# EAGLE board BITalino_V3 (EAGLE 6.3)
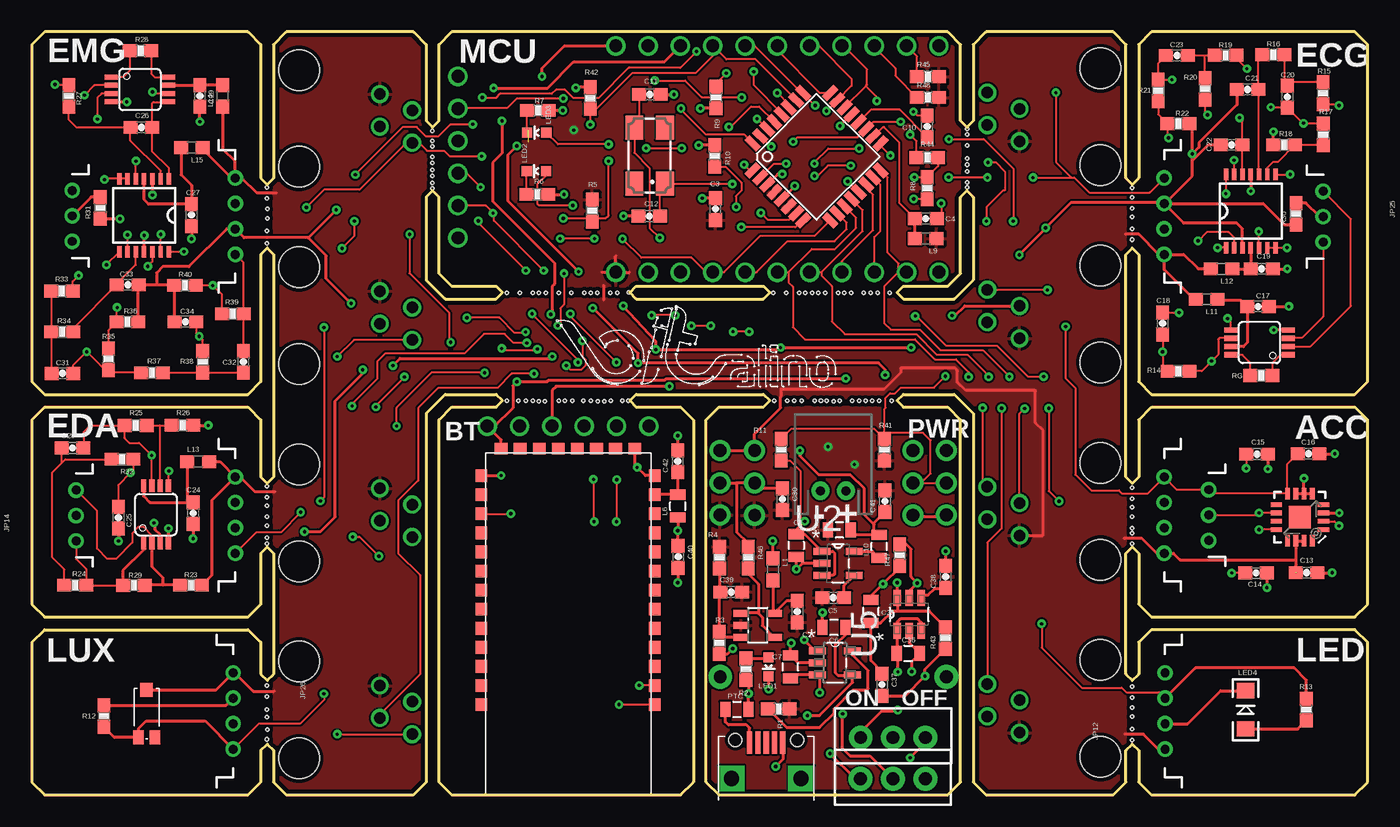
[diagram p3: board, top side]
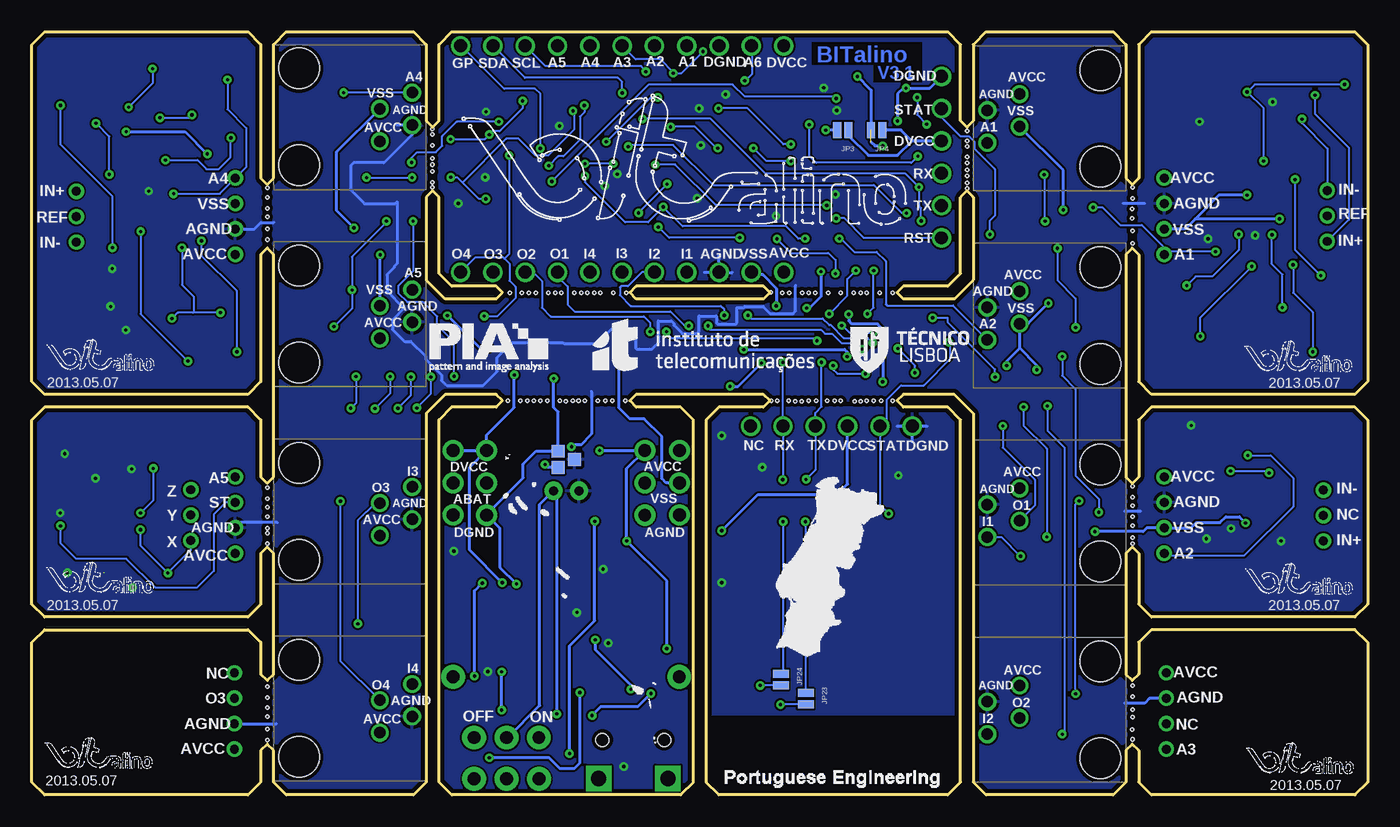
[diagram p4: board, bottom side, seen from below]

Size 105 x 60 mm. Coordinates in mm from the lower left corner, seen from the top.
Outline: 105,1 105,12 104,13 88,13 87,12 87,9.5 86.5,9 86,9.5 86,19 86.5,19.5 87,19 87,15 88,14 104,14 105,15 105,29.5 104,30.5 88,30.5 87,29.5 87,25 86.5,24.5 86,25 86,42.5 86.5,43 87,42.5 87,32.5 88,31.5 104,31.5 105,32.5 105,59 104,60 88,60 87,59 87,48.5 86.5,48 86,48.5 86,59 85,60 75,60 74,59 74,53 73.5,52.5 73,53 73,59 72,60 33,60 32,59 32,53 31.5,52.5 31,53 31,59 30,60 20,60 19,59 19,48.5 18.5,48 18,48.5 18,59 17,60 1,60 0,59 0,32.5 1,31.5 17,31.5 18,32.5 18,42.5 18.5,43 19,42.5 19,25 18.5,24.5 18,25 18,29.5 17,30.5 1,30.5 0,29.5 0,15 1,14 17,14 18,15 18,19 18.5,19.5 19,19 19,9.5 18.5,9 18,9.5 18,12 17,13 1,13 0,12 0,1 1,0 17,0 18,1 18,3.5 18.5,4 19,3.5 19,1 20,0 30,0 31,1 31,30 32.5,31.5 36.5,31.5 37,31 36.5,30.5 33,30.5 32,29.5 32,1 33,0 51,0 52,1 52,29.5 51,30.5 47.5,30.5 47,31 47.5,31.5 57.5,31.5 58,31 57.5,30.5 54,30.5 53,29.5 53,1 54,0 72,0 73,1 73,29.5 72,30.5 68.5,30.5 68,31 68.5,31.5 72.5,31.5 74,30 74,1 75,0 85,0 86,1 86,3.5 86.5,4 87,3.5 87,1 88,0 104,0 105,1
Outline: 74,47 74,40.5 72.5,39 68.5,39 68,39.5 68.5,40 72,40 73,41 73,47 73.5,47.5 74,47
Outline: 32,41 32,47 31.5,47.5 31,47 31,40.5 32.5,39 36.5,39 37,39.5 36.5,40 33,40 32,41
Outline: 47.5,40 57.5,40 58,39.5 57.5,39 47.5,39 47,39.5 47.5,40
Copper layers (1*16): Top 0.035mm / dielectric 1.5mm / Bottom 0.035mm
Design rules "default *": minimum track width 6mil, minimum drill 10mil, track to track 6mil, track to pad 6mil, pad to pad 8mil, via to via 8mil, smd to smd 8mil, copper to edge 12mil, drill to drill 8mil, minimum pad ring 10mil, minimum via ring 8mil, stop-mask expansion 4mil, vias tented up to drill 0mil, thermal gap 10mil
Holes 0.25 mm at 18.49,46.91 18.52,46.08 18.52,45.34 18.49,44.35 18.49,43.36 37.34,30.99 18.49,23.42 18.49,22.76 18.49,21.87 18.49,21.18 18.49,20.24 18.49,19.76 18.49,6.73 18.49,6.12 18.52,5.14 18.49,4.38 37.34,39.5 38.35,39.5 39.37,39.5 40.39,39.5 41.4,39.5 42.42,39.5 43.43,39.5 44.45,39.5 45.47,39.5 38.25,30.99 39.37,30.99 40.31,30.96 41.4,30.99 42.49,30.99 43.36,30.99 44.48,30.96 45.49,30.99 46.41,30.99 58.37,30.99 59.36,30.99 60.5,30.99 61.52,30.99 62.48,30.99 63.5,30.99 64.49,30.99 65.53,30.99 66.6,30.99 67.59,30.99 58.29,39.5 59.31,39.5 60.33,39.5 61.34,39.5 62.36,39.5 63.37,39.5 64.39,39.5 65.41,39.5 66.47,39.5 67.44,39.5 31.5,52.2 31.5,51 31.5,50.16 31.5,49.15 31.5,48.13 73.51,51.94 73.51,51.05 73.51,50.04 73.51,49.02 73.51,48.16 86.49,47.73 86.49,46.99 86.49,46.13 86.49,45.44 86.49,44.5 86.49,43.66 86.49,24.16 86.49,23.29 86.49,22.61 86.49,21.89 86.49,20.98 86.49,20.6 86.49,8.53 86.49,7.67 86.49,6.86 86.49,6.15 86.49,5.18 18.49,47.77 18.49,24.27 18.49,7.73 86.49,19.74 46.92,39.52 18.49,8.59 86.49,4.32 46,39.5 43.92,39.5 39.85,39.5 61.82,39.47 60.81,39.5 63.86,39.5 65.94,39.5 38.81,30.99 41.91,30.99 43.94,30.99 45.01,30.96 39.85,30.96 59.92,30.99 62.03,30.99 63.02,30.96 65.05,30.99 66.07,30.99 31.5,47.7 31.5,48.67 31.5,49.68 73.51,49.56 46.86,30.99 31.5,51.41 73.51,47.75 73.51,52.35

## Footprints (pad centres in the part's own frame; a part is rotated, then mirrored left to right if it is on the bottom)
SMD = drill 0.9: 1 -6.36,-1.9; 2 -8.9,-3.17; 3 -8.9,-5.72; 4 -6.36,-4.45 | hole 3.2: 0,-7.62; 0,0
0805 = smd 0.8 x 1.2: 1 -0.9,0; 2 0.9,0
0603-CAP = smd 1.1 x 1: 1 -0.85,0; 2 0.85,0
SOT23-5 = smd 0.55 x 1.2: 1 -0.95,-1.3; 2 0,-1.3; 3 0.95,-1.3; 4 0.95,1.3; 5 -0.95,1.3
MSOP08 = smd 0.4 x 1: 1 -0.976,-2.263; 2 -0.326,-2.263; 3 0.324,-2.263; 4 0.974,-2.263; 5 0.974,2.262; 6 0.324,2.262; 7 -0.326,2.262; 8 -0.976,2.262
TSSOP14 = smd 0.9 x 0.35: 1 -2.875,1.95; 2 -2.875,1.3; 3 -2.875,0.65; 4 -2.875,0; 5 -2.875,-0.65; 6 -2.875,-1.3; 7 -2.875,-1.95; 8 2.875,-1.95; 9 2.875,-1.3; 10 2.875,-0.65; 11 2.875,0; 12 2.875,0.65; 13 2.875,1.3; 14 2.875,1.95
JST-2-PTH-NS = drill 0.7 pad 1.448: 1 -1,0; 2 1,0
FCI-10103594-0001LF = smd 0.4 x 1.75: 1 -1.3,4.525; 2 -0.65,4.525; 3 0,4.525; 4 0.65,4.525; 5 1.3,4.525 | drill 1.2 pad 2 square: P$3 -2.725,1.7; P$4 2.725,1.7 | hole 1.05: -2.425,4.73; 2.425,4.73
SJ_2S-NO-NS = smd 0.635 x 1.27: 1 -0.45,0; 2 0.45,0
JST-3-PTH = drill 0.7: 1 -2,-5; 2 0,-5; 3 2,-5
JST-4-PTH = drill 0.7: 1 -3,-5; 2 -1,-5; 3 1,-5; 4 3,-5
1X03_NO_SILK = drill 1.016 pad 1.651: 1 0,0; 2 2.54,0; 3 5.08,0
1X06_HOLES_ONLY = drill 1.016 pad 1.27: 1 0,0; 7 2.54,0; 8 5.08,0; 9 7.62,0; 10 10.16,0; 11 12.7,0 | drill 0.889 pad 0.813: 2 2.54,0; 3 5.08,0; 4 7.62,0; 5 10.16,0; 6 12.7,0
1X11_HOLES_ONLY = drill 1.016 pad 1.27: 1 0,0; 12 5.08,0; 13 7.62,0; P$1 2.54,0; P$2 10.16,0; P$3 12.7,0; P$4 15.24,0; P$5 17.78,0; P$6 20.32,0; P$7 22.86,0; P$8 25.4,0 | drill 0.889 pad 0.813: 2 2.54,0; 3 5.08,0; 4 7.62,0; 5 10.16,0; 6 12.7,0; 7 15.24,0; 8 17.78,0; 9 20.32,0; 10 22.86,0; 11 25.4,0
1X01NS = drill 1.016 pad 1.88: 1 0,0
0603 = smd 1.1 x 1: 1 -0.85,0; 2 0.85,0
LED-0603 = smd 0.8 x 0.8: A 0,-0.75; C 0,0.75
LED-1206 = smd 1.2 x 1.4: A -1.5,0; C 1.5,0
CTS406 = smd 1.9 x 1.4: 1 -2.2,-1.2; 2 2.2,-1.2; 3 2.2,1.2; 4 -2.2,1.2
0603-RES = smd 1.1 x 1: 1 -0.85,0; 2 0.85,0
SWITCH-SPDT = drill 1.016 pad 1.88: 1 0,2.54; 2 0,0; 3 0,-2.54
SOT95P300X145-5N = smd 1.321 x 0.559: 1 -1.372,0.94; 2 -1.372,0; 3 -1.372,-0.94; 4 1.372,-0.94; 5 1.372,0.94
SOT95P280X130-5N = smd 1.321 x 0.559: 1 -1.27,0.94; 2 -1.27,0; 3 -1.27,-0.94; 4 1.27,-0.94; 5 1.27,0.94
TQFP32-08 = smd 1.27 x 0.559: 1 -4.293,2.8; 2 -4.293,2; 3 -4.293,1.2; 4 -4.293,0.4; 5 -4.293,-0.4; 6 -4.293,-1.2; 7 -4.293,-2; 8 -4.293,-2.8; 17 4.293,-2.8; 18 4.293,-2; 19 4.293,-1.2; 20 4.293,-0.4; 21 4.293,0.4; 22 4.293,1.2; 23 4.293,2; 24 4.293,2.8 | smd 0.559 x 1.27: 9 -2.8,-4.293; 10 -2,-4.293; 11 -1.2,-4.293; 12 -0.4,-4.293; 13 0.4,-4.293; 14 1.2,-4.293; 15 2,-4.293; 16 2.8,-4.293; 25 2.8,4.293; 26 2,4.293; 27 1.2,4.293; 28 0.4,4.293; 29 -0.4,4.293; 30 -1.2,4.293; 31 -2,4.293; 32 -2.8,4.293
LFCSP-16 = smd 1.75 x 1.75: 0 0,0 | smd 0.889 x 0.37: 1 -1.852,0.975; 2 -1.852,0.325; 3 -1.852,-0.325; 4 -1.852,-0.975; 9 1.852,-0.975; 10 1.852,-0.325; 11 1.852,0.325; 12 1.852,0.975 | smd 0.37 x 0.889: 5 -0.975,-1.852; 6 -0.325,-1.852; 7 0.325,-1.852; 8 0.975,-1.852; 13 0.975,1.852; 14 0.325,1.852; 15 -0.325,1.852; 16 -0.975,1.852
SOT95P280X145-6N = smd 1.27 x 0.559: 1 -1.295,0.94; 2 -1.295,0; 3 -1.295,-0.94; 4 1.295,-0.94; 5 1.295,0; 6 1.295,0.94
BLUETOOTH = smd 0.9 x 1: P$1 -0.312,19.79; P$2 -0.312,18.29; P$3 -0.312,16.79; P$4 -0.312,15.29; P$5 -0.312,13.79; P$6 -0.312,12.29; P$7 -0.312,10.79; P$8 -0.312,9.29; P$9 -0.312,7.79; P$10 -0.312,6.29; P$11 -0.312,4.79; P$12 -0.312,3.29; P$13 -0.312,1.79; P$22 13.312,1.79; P$23 13.312,3.29; P$24 13.312,4.79; P$25 13.312,6.29; P$26 13.312,7.79; P$27 13.312,9.29; P$28 13.312,10.79; P$29 13.312,12.29; P$30 13.312,13.79; P$31 13.312,15.29; P$32 13.312,16.79; P$33 13.312,18.29; P$34 13.312,19.79 | smd 1 x 0.9: P$14 1.27,-0.312; P$15 2.77,-0.312; P$16 4.27,-0.312; P$17 5.77,-0.312; P$18 7.27,-0.312; P$19 8.77,-0.312; P$20 10.27,-0.312; P$21 11.77,-0.312
GND_CONNECT = smd 1.016 x 1.016: 1 -1.016,0; 2 -1.016,-1.27; 3 0.254,-0.635
TEMT6000-SEN = smd 1.1 x 0.8: BASE -1.87,-0.65; EMITTER -1.87,0.65 | smd 1.1 x 1: COLLECTOR 1.86,0.01

## Placement (x,y rotation side)
ACC  RJ22  [SMD]  84,34 180 bottom
C1  10u  [0805]  60.08,19.61 270 top
C2  100n  [0603-CAP]  60.17,14.42 270 top
C3  100n  [0603-CAP]  53.73,46.06 90 top
C4  100n  [0603-CAP]  70.28,45.31 0 top
C5  470p  [0603-CAP]  62.99,15.51 180 top
C6  10u  [0805]  63.05,13.17 180 top
C7  10u  [0805]  59.63,10.07 90 top
C9  22uF  [0805]  63.47,20.83 180 top
C10  100n  [0603-CAP]  70.37,52.57 90 top
C11  22p  [0603-CAP]  48.58,55.07 0 top
C12  22p  [0603-CAP]  48.52,45.51 180 top
C13  100n  [0603-CAP]  100.2,17.47 0 top
C14  470n  [0603-CAP]  96.24,17.45 180 top
C15  470n  [0603-CAP]  96.3,26.8 0 top
C16  470n  [0603-CAP]  100.34,26.82 0 top
C17  100n  [0603-CAP]  96.39,38.41 0 top
C18  220n  [0603-CAP]  88.88,37.07 90 top
C19  100n  [0603-CAP]  96.68,41.36 0 top
C20  220n  [0603-CAP]  98.67,54.89 270 top
C21  220n  [0603-CAP]  95.57,55.46 0 top
C22  220n  [0603-CAP]  94.31,51.1 0 top
C23  220n  [0603-CAP]  90,58.15 180 top
C24  100n  [0603-CAP]  12.68,22.16 270 top
C25  220n  [0603-CAP]  6.81,21.81 270 top
C26  220n  [0603-CAP]  8.6,52.47 0 top
C27  100n  [0603-CAP]  12.55,45.59 270 top
C28  220n  [0603-CAP]  3.2,27.28 0 top
C29  100n  [0603-CAP]  13.21,54.96 270 top
C30  100n  [0603-CAP]  59,23.27 270 top
C31  100n  [0603-CAP]  2.42,33.14 0 top
C32  100n  [0603-CAP]  16.64,34.07 90 top
C33  100n  [0603-CAP]  7.54,40.11 180 top
C34  100n  [0603-CAP]  12.06,37.21 0 top
C35  22uF  [0805]  65.96,14.43 90 top
C36  4.7uF  [0805]  68.88,11.13 0 top
C37  15p  [0603-CAP]  66.83,8.66 270 top
C38  10p  [0603-CAP]  71.83,17.14 90 top
C39  4.7u  [0603-CAP]  54.97,15.95 0 top
C40  4.7u  [0603-CAP]  50.8,18.72 270 top
C41  1u  [0603-CAP]  67.06,23.09 90 top
C42  1u  [0603-CAP]  50.77,26.24 90 top
D1  RJ22  [SMD]  21,26 0 bottom
D2  RJ22  [SMD]  21,10.5 0 bottom
D4  RJ22  [SMD]  84,3 180 bottom
ECG  RJ22  [SMD]  84,49.5 180 bottom
EDA  RJ22  [SMD]  21,41.5 0 bottom
EMG  ECG  [SMD]  21,57 0 bottom
IC1  OPA364  [SOT23-5]  57.05,13.34 270 top
IC2  INA333 (MSOP8)  [MSOP08]  96.5,35.58 90 top
IC3  INA333 (MSOP8)  [MSOP08]  8.5,55.47 270 top
IC4  AD8694 (TSSOP14)  [TSSOP14]  95.81,45.9 90 top
IC5  AD8694 (TSSOP14)  [TSSOP14]  8.83,45.58 270 top
IC6  AD8692 (MSOP8)  [MSOP08]  9.77,22.05 0 top
JP1  [JST-2-PTH-NS]  62.99,23.91 0 top
JP2  USB-RECEPTABLE  [FCI-10103594-0001LF]  57.72,-0.4 0 top
JP3  [SJ_2S-NO-NS]  41.25,52.27 180 bottom
JP4  [SJ_2S-NO-NS]  38.58,52.27 180 bottom
JP5  [JST-3-PTH]  87.5,22 90 top
JP6  [JST-4-PTH]  21,45.5 270 top
JP7  [1X03_NO_SILK]  71.9,22 90 top
JP8  [JST-4-PTH]  21,22 270 top
JP9  [JST-4-PTH]  84,45.5 90 top
JP10  [JST-4-PTH]  84,22 90 top
JP12  [JST-4-PTH]  84.07,6.6 90 top
JP13  [JST-3-PTH]  -1.82,45.53 90 top
JP14  [JST-3-PTH]  -1.52,21.97 90 top
JP16  [1X06_HOLES_ONLY]  33.5,56.5 270 top
JP17  [1X03_NO_SILK]  69.24,22 90 top
JP18  [1X06_HOLES_ONLY]  35.8,29 0 top
JP19  [1X03_NO_SILK]  54.1,22 90 top
JP20  M11POGOPIN_HOLES_ONLY  [1X11_HOLES_ONLY]  71.3,58.9 180 top
JP21  M11POGOPIN_HOLES_ONLY  [1X11_HOLES_ONLY]  45.9,41.1 0 top
JP22  [1X03_NO_SILK]  56.82,22 90 top
JP23  [SJ_2S-NO-NS]  44.16,7.58 270 bottom
JP24  [SJ_2S-NO-NS]  46.12,9.07 270 bottom
JP25  [JST-3-PTH]  106.5,45.47 270 top
JP26  [JST-4-PTH]  20.83,6.6 270 top
JP27  M01SMDNS  [1X01NS]  54.11,9.29 0 top
JP28  M01SMDNS  [1X01NS]  71.88,9.29 0 top
L1  1uH  [0603]  58.25,17.74 270 top
L6  5uH  [0805]  50.77,22.71 90 top
L9  1uH  [0603]  70.27,43.74 180 top
L10  10uH  [0805]  66.6,19.53 90 top
L11  1uH  [0603]  92.34,38.97 180 top
L12  1uH  [0603]  93.51,41.36 180 top
L13  [0603]  13.07,26.2 0 top
L14  1uH  [0603]  15,54.96 90 top
L15  1uH  [0603]  12.58,50.89 180 top
LED  RJ22  [SMD]  84,18.5 180 bottom
LED1  ORANGE  [LED-0603]  57.91,10.07 180 top
LED2  WHITE  [LED-0603]  39.66,49.05 90 top
LED3  RED  [LED-0603]  39.69,52.07 90 top
LED4  [LED-1206]  95.4,6.7 90 top
PTC  [0805]  55.42,6.73 0 top
Q1  8MHz  [CTS406]  48.56,50.26 90 top
R1  2k  [0603-RES]  58.7,6.78 180 top
R2  1k  [0603-RES]  56.13,9.89 90 top
R3  100k  [0603-RES]  54.03,11.95 270 top
R4  100k  [0603-RES]  54.06,18.67 270 top
R5  10k  [0603-RES]  44.05,45.94 90 top
R6  1k  [0603-RES]  39.73,47.22 180 top
R7  1k  [0603-RES]  39.78,53.83 180 top
R8  25k  [0603-RES]  70.37,47.71 270 top
R9  25k  [0603-RES]  53.77,54.84 90 top
R10  25k  [0603-RES]  53.67,50.24 270 top
R11  1k  [0603-RES]  58.9,27.15 270 top
R12  10k  [0603-RES]  5.67,6.2 270 top
R13  300  [0603-RES]  100.18,6.72 90 top
R14  1.446M  [0603-RES]  90.13,33.32 0 top
R15  4.64k  [0603-RES]  101.48,55.17 270 top
R16  70.52k  [0603-RES]  97.58,58.2 0 top
R17  9k  [0603-RES]  101.51,51.92 270 top
R18  1k  [0603-RES]  98.44,51.11 180 top
R19  5.59k  [0603-RES]  93.83,58.15 0 top
R20  58.54k  [0603-RES]  92.22,55.52 90 top
R21  9k  [0603-RES]  88.53,55.38 270 top
R22  1k  [0603-RES]  90.12,52.77 0 top
R23  1M  [0603-RES]  12.52,16.5 0 top
R24  102.31k  [0603-RES]  3.41,16.49 0 top
R25  1k  [0603-RES]  8.16,29.06 0 top
R26  1k  [0603-RES]  11.85,29.06 0 top
R27  72.34k  [0603-RES]  2.92,54.96 90 top
R28  11K  [0603-RES]  8.55,58.51 0 top
R29  1M  [0603-RES]  8.03,16.48 0 top
R30  100K  [0603-RES]  99.36,45.69 90 top
R31  100K  [0603-RES]  5.38,46.15 90 top
R32  204.62k  [0603-RES]  7.11,26.39 180 top
R33  1.02k  [0603-RES]  2.36,39.61 0 top
R34  15.52k  [0603-RES]  2.39,36.41 180 top
R35  9k  [0603-RES]  6.03,34.26 90 top
R36  1k  [0603-RES]  7.52,37.19 0 top
R37  1.23k  [0603-RES]  9.44,33.2 180 top
R38  12.88k  [0603-RES]  13.44,34.06 270 top
R39  9k  [0603-RES]  15.8,37.84 180 top
R40  1k  [0603-RES]  12.04,40.08 180 top
R41  1k  [0603-RES]  67.01,27.14 90 top
R42  25k  [0603-RES]  43.89,54.79 270 top
R43  51k  [0603-RES]  71.81,12.34 90 top
R44  25k  [0603-RES]  70.38,50.11 180 top
R45  10K  [0603-RES]  70.43,56.46 0 top
R46  5  [0603-RES]  56.31,18.67 270 top
R47  30.1k  [0603-RES]  68.22,18.85 90 top
R48  10K  [0603-RES]  70.43,54.84 0 top
RG  10k  [0603-RES]  96.64,32.98 0 top
S1  [SWITCH-SPDT]  67.69,1.26 90 top
S2  [SWITCH-SPDT]  67.69,4.51 90 top
U1  MCP73831T-2ATI/OT  [SOT95P300X145-5N]  63.13,10.39 0 top
U2  MIC5205  [SOT95P280X130-5N]  63.37,18.21 0 top
U3  ATMEGA328p  [TQFP32-08]  61.69,50.17 45 top
U4  ADXL335  [LFCSP-16]  99.67,21.84 180 top
U5  TPS73001-3.3V  [SOT95P280X145-6N]  68.96,14.2 90 top
U$1  BLUETOOTH  [BLUETOOTH]  48.66,26.9 180 top
U$2  GND_CONNECT  [GND_CONNECT]  62.61,27.03 0 bottom
U$4  [BITALINO_LOGO2]  70.87,44.83 0 bottom
U$5  [IT_LOGO]  61.23,33.24 0 bottom
U$6  [TECNICO_LOGO]  39.55,32.86 0 bottom
U$7  [PIA_LOGO]  73.95,33.13 0 bottom
U$8  [BITALINO_LOGO2_SMALL]  41.2,32 0 top
U$9  [PT_IMAGE]  70,0.43 0 bottom
U$10  TEMT6000  [TEMT6000-SEN]  9.03,6.4 90 top
U$11  [BITALINO_LOGO2_SENSORS]  9.68,33.25 0 bottom
U$12  [BITALINO_LOGO2_SENSORS]  9.55,1.65 0 bottom
U$13  [BITALINO_LOGO2_SENSORS]  9.63,15.75 0 bottom
U$14  [BITALINO_LOGO2_SENSORS]  103.84,33.35 0 bottom
U$15  [BITALINO_LOGO2_SENSORS]  103.96,2.06 0 bottom
U$16  [BITALINO_LOGO2_SENSORS]  103.86,15.85 0 bottom

## Tracks (layer width: path | path; a pad name or v marks a point on that pad's centre or on a via)
A0  (via drill 0.25)
  Top 0.152: C23.2 88.53,57.52 R21.1 v89.61,56.23 v89.61,56.24 | IC4.14 v93.86,47.27 v93.85,47.27 | JP20.5 61.85,58.9 64.44,56.31 64.44,55.75 U3.23 v62.46,53.77 | v78.69,48.54 81.71,48.54 | 81.71,48.54 81.94,48.54 83.11,47.37 87.87,47.37 JP9.4 | v80.49,55.22 80.49,49.76 81.71,48.54 | R8.2 v69.31,46.86 | v75.11,48.54 72.08,48.54 v72.06,48.56
  Bottom 0.152: v93.85,47.27 90.23,47.27 JP9.4 88.14,49.36 88.14,52.43 89.61,53.9 v89.61,56.24 | v62.46,53.77 62.36,53.67 62.36,52.35 64.44,50.27 65.41,50.27 66.73,51.59 67.72,51.59 71.15,48.16 | ECG.3 v80.49,55.22 | 71.15,48.16 69.85,46.86 v69.31,46.86 | v72.06,48.56 71.55,48.56 71.15,48.16 | v78.69,48.54 v75.11,48.54
A1  (via drill 0.25)
  Top 0.152: U3.24 61.96,55.19 58.6,58.55 JP20.6 | R9.2 53.77,55.93 v54.59,56.74 | v25.43,48.77 29.16,52.5 30.25,52.5 30.99,51.77 31.95,51.77 32.92,52.73 v34.67,52.73 | v25.35,45.11 25.35,43.94 v24.38,42.98 | v22.96,7.95 22.96,7.47 21.11,5.61 17.84,5.61 JP26.4 | v22.96,36.75 22.96,23.39 v22.68,23.11 | v52.25,58.45 50.98,57.17 46.91,57.17 44.53,54.79 42.57,54.79 41.91,55.45 41.2,55.45 40.87,55.12 36.8,55.12 36.52,54.84 v35.41,54.84
  Top 0.254: R12.2 6.49,4.53 U$10.EMITTER 8.38,5.21 8.99,5.82 13.62,5.82 JP26.4
  Bottom 0.152: JP20.6 57.54,57.84 55.6,57.84 54.59,56.82 v54.59,56.74 53.95,56.74 v52.25,58.45 | v25.43,48.77 25.43,45.19 v25.35,45.11 | v24.38,42.98 24.38,40.46 22.96,39.04 v22.96,36.75 | v22.96,7.95 22.96,22.84 v22.68,23.11 | v35.41,54.84 35.41,53.47 v34.67,52.73
A1_OUT  (via drill 0.25)
  Top 0.152: R17.1 99.95,52.77 | 99.95,52.77 C20.2 97.42,54.05 v97.38,54.08 | R19.2 94.67,57.93 v95.5,57.1 | 99.95,52.77 v99.95,52.8 v99.95,52.81 | IC4.8 98.89,48.78 v98.91,48.79
  Bottom 0.152: v95.5,57.1 95.5,55.96 v97.38,54.08 | v98.91,48.79 98.91,51.77 v99.95,52.81 99.92,52.81 99.92,52.8
A3  (via drill 0.25)
  Top 0.152: C28.2 4.06,27.29 4.06,28.52 4.57,29.03 7.29,29.03 R25.1 7.32,28.04 7.67,27.69 8.43,27.69 v9.42,26.7 9.44,26.68 IC6.7 | v64.36,49.48 62.56,49.48 61.75,48.67 v61.52,48.67 | R10.2 54.52,49.39 55.78,48.13 55.78,47.5 55.35,47.07 55.35,46.25 v55.37,46.23 | v44.22,43.74 v41.53,43.74 | EDA.3 25.32,35.78 v24,34.47 | v21.13,22.23 21.13,22.2 19.58,20.65 17.65,20.65 JP8.4 | JP20.7 56.82,58.9 60.53,55.19 U3.25 60.63,55.14 v61.57,54.2
  Bottom 0.152: v9.42,26.7 7.62,26.7 5.87,24.94 5.87,22.66 9.73,18.8 15.8,18.8 JP8.4 | v61.57,54.2 61.57,53.7 61.92,53.34 61.92,51.51 63.22,50.22 63.63,50.22 v64.36,49.48 | v61.52,48.67 61.52,48.18 58.37,45.03 56.57,45.03 v55.37,46.23 53.85,44.7 45.72,44.7 44.76,43.74 v44.22,43.74 | v41.53,43.74 41.4,43.74 40.36,42.7 38.61,42.7 37.87,41.96 37.87,38.58 37.77,38.48 32.6,38.48 EDA.3 | v24,34.47 24,32.97 22.96,31.93 22.96,25.12 21.13,23.29 v21.13,22.23
A5  (via drill 0.25)
  Top 0.152: C32.2 16.64,37.83 R39.1 16.65,41.85 JP6.4 | IC5.14 11.94,42.7 v11.96,42.72 | v35.36,50.22 32.84,50.22 32.41,50.65 31.06,50.65 30.43,51.28 EMG.3 29.46,51.28 25.76,47.57 22.96,47.57 v21.59,46.2 | U3.26 60.07,54.66 56.9,57.84 54.58,57.84 53.92,58.5 | 53.92,58.5 JP20.8 | v43.89,52.7 R42.2 44.39,53.94 47.22,56.77 52.2,56.77 53.92,58.5
  Bottom 0.152: v11.96,42.72 15.78,42.72 JP6.4 16.05,42.55 16.05,43.1 17.75,44.81 19.46,44.81 20.85,46.2 v21.59,46.2 | v35.36,50.22 35.87,49.71 43.36,49.71 43.89,50.24 v43.89,52.7
A6  (via drill 0.25)
  Top 0.152: v48.97,56.16 51.36,56.16 52.65,54.86 55.78,54.86 v55.8,54.84 | v59.84,51.36 60.2,51.71 64.9,51.71 65.54,52.36 U3.19 65.59,52.36 66.17,52.93 v68.3,52.93 | JP7.2 JP17.2 69.9,24.54 70.64,25.27 70.64,27.89 70.05,28.47 67.49,28.47 R41.2 | R11.1 59.72,28.8 66.2,28.8 R41.2 | v75.16,49.73 75.77,49.73 76.48,49.02 76.48,47.52 76.33,47.52 75.03,46.23 v75.03,45.11 | R41.2 67.01,30.33 67.11,30.43 67.11,31.22 67.46,31.57 67.84,31.57 68.3,32.03 70.92,32.03 v71.81,32.92
  Top 0.254: R41.2 | R11.1
  Bottom 0.152: v55.8,54.84 56.36,54.84 v59.84,51.36 | JP20.10 48.39,58.85 48.39,56.67 48.9,56.16 v48.97,56.16 | v75.16,49.73 75.16,50.09 74.73,50.52 73.25,50.52 72.75,51.03 72.75,51.79 71.6,52.93 v68.3,52.93 | v75.03,45.11 75.03,41.17 76.2,40.01 76.2,39.47 75.46,38.73 74.24,38.73 73.13,37.62 73.13,36.93 71.81,35.61 v71.81,32.92
A7  (via drill 0.25)
  Top 0.152: C16.1 98.7,26.03 U4.8 92.81,23.69 JP5.3 90,24 JP10.4 87.72,23.72 85.67,23.72 85.45,23.95 83.26,23.95 82.02,25.2 82.02,32 81.25,32.77 v81.25,36.83 | U3.22 65.55,55.73 | 65.55,55.73 65.66,55.84 65.66,57.05 63.81,58.9 JP20.4 | v72.08,51.56 74.83,51.56 77.14,49.25 v77.14,45.11 | ACC.3 79.81,39.72 v79.83,39.7 | v66.42,54.56 66.42,54.86 65.55,55.73 | R44.2 69.53,51.42 v69.04,51.92
  Bottom 0.152: v77.14,45.11 77.14,45.01 79.83,42.32 v79.83,39.7 79.83,38.25 v81.25,36.83 | v72.08,51.56 69.39,51.56 v69.04,51.92 | 68.81,52.15 v69.04,51.92 | v66.42,54.56 66.42,54 68.25,52.17 68.78,52.17 v69.04,51.92
AVCC  (via drill 0.25)
  Top 0.254: v63.73,6.38 63.73,3.66 64.31,3.07 65.87,3.07 S1.2
  Bottom 0.254: v63.73,6.38 63.73,23.67 63.98,23.93
BATTERY  (via drill 0.25)
  Top 0.152: R11.2 59.58,26.3 60.4,25.48 60.4,21.87 v60.76,21.51
  Top 0.254: v60.76,21.51 60.08,20.84 C1.1 60.74,20.51 U2.1 62.97,19.15 63.09,19.02 63.09,17.37 62.99,17.27 U2.3 | v62.74,3.25 64.73,1.26 S1.1
  Bottom 0.254: v62.74,3.25 62.74,11.71 60.76,13.69 v60.76,21.51
BATTERY_D  (via drill 0.25)
  Top 0.254: v68.07,6.68 68.02,6.63 66.8,6.63 65.15,4.98 S2.1 | v68.07,9.68 68.07,11.04 C36.1 68.02,11.42 U5.1 68.02,13.61 68.28,13.87 69.62,13.87 69.9,13.59 U5.3
  Bottom 0.254: v68.07,6.68 v68.07,9.68
BGND  (via drill 0.25)
  Top 0.254: C1.2 60.08,17.77 v60.1,17.75 60.55,18.21 U2.2 | U1.2 60.22,10.39 C7.2 59.63,11.88 v59.69,11.94 | JP2.5 59.02,2.79 v58.47,2.23 | C6.2 v62.15,14.35 | C36.2 69.78,11.47 | U5.2 68.96,11.95 C36.2 | v69.16,9.7 69.16,10.51 C36.2 | C38.2 v71.83,19.18
  pour Bottom: 52.83,30.48 52.83,0 73.15,0 73.15,30.48
BUFFER_OUT  (via drill 0.25)
  Top 0.152: IC4.6 IC4.7 v98.65,43.03 | R15.2 102.63,54.32 v102.74,54.2
  Bottom 0.152: v98.65,43.03 98.65,47.04 102.74,51.13 v102.74,54.2
D2  (via drill 0.25)
  Top 0.152: v51.03,53.98 51.03,53.87 52.96,51.94 55.96,51.94 U3.32 | v45.34,51.16 41.35,51.16 LED3.A
  Bottom 0.152: v45.34,51.16 45.92,51.16 48.74,53.98 v51.03,53.98
D3  (via drill 0.25)
  Top 0.152: LED2.A 40.41,48.69 39.73,48.01 39.73,46.51 39.88,46.35 v42.52,46.35 | U3.1 56.42,49.12 v55.98,49.55
  Bottom 0.152: v42.52,46.35 51.23,46.35 54.43,49.55 v55.98,49.55
D4  (via drill 0.25)
  Top 0.152: U3.2 58.32,49.63 v59.28,49.63 | v61.52,49.63 61.52,49.73 62.61,50.83 v65.02,50.83
  Bottom 0.152: v59.28,49.63 v61.52,49.63 | v65.02,50.83 65.02,55.12 65.43,55.52 67.87,55.52 71.25,58.9 JP20.1
DGND  (via drill 0.25)
  Top 0.254: JP20.9 49.71,57.63 42.6,57.63 40.54,55.58 v36.3,55.58 | v36.96,52.98 36.96,50.44 36.22,49.71 36.22,46.69 41.07,41.83 41.07,40.18 40.89,40.01 40.89,37.9 v40.79,37.8 | v63.98,32.74 49.86,32.74 49.73,32.61 40.64,32.61 40.51,32.49 v38.12,32.49 37.82,32.18 37.82,30.43 36.39,29 JP18.1 36.88,27.91 U$1.P$21 | JP7.1 71.81,21.91 69.33,21.91 JP17.1 | R47.1 68.22,17.91 v66.9,16.59 65.96,15.65 C35.2 | U$1.P$22 36.69,25.11 v36.88,25.12 | C42.2 v50.77,28.25 | U$1.P$13 48.22,25.11 v47.57,25.76 47.38,25.94 U$1.P$14 | C40.2 50.8,16.71 v50.77,16.69
  Bottom 0.254: JP16.1 34.42,55.58 v36.3,55.58 36.5,55.58 36.96,55.12 v36.96,52.98 | v63.98,32.74 63.98,30.48 63.63,30.12 U$2.1 65.35,27.03 66.37,26.01 66.37,24.94 69.24,22.07 JP17.1 68.22,20.98 68.22,17.91 v66.9,16.59 | v40.79,37.8 40.79,37.26 40.56,37.03 38.53,37.03 38.1,36.6 38.1,32.51 v38.12,32.49 38.15,32.49 | 34.62,28.98 36.98,28.98 | 35.81,29.01 35.81,27.76
  pour Bottom: 32,30.48 32,6.35 52.07,6.35 52.07,30.48
DI1  (via drill 0.25)
  Top 0.152: U3.9 61.55,43.97 57.28,43.97 54.41,41.1 JP21.4 52.98,41.1 51.84,42.24 47.9,42.24 v46.43,43.71 | v41.83,41 41.83,38.56 41.55,38.28 41.55,37.11 v41.35,36.91 | v34.19,37.52 36.75,37.52 37.9,36.37 38.79,36.37 v38.81,36.4 | v27.05,30.5 27.05,30.63 v29.29,32.87 | v25.22,20.3 25.76,20.3 v27.28,18.77
  Bottom 0.152: v41.83,41 41.83,42.06 42.39,42.62 45.34,42.62 v46.43,43.71 | v41.35,36.91 41.27,36.91 40.74,36.37 38.84,36.37 v38.81,36.4 | v34.19,37.52 33.02,37.52 33.02,37.19 29.29,33.45 v29.29,32.87 | v27.05,30.5 27.05,29.06 25.22,27.23 v25.22,20.3 | D1.3 28.79,20.28 v27.28,18.77
DI2  (via drill 0.25)
  Top 0.152: JP21.5 56.98,41.1 59.41,43.54 63.09,43.54 64.03,44.48 64.03,45 U3.10 | v50.57,37.72 v48.72,37.72 | v38.91,35.53 37.87,35.53 37.16,36.25 35.53,36.25 34.01,34.72 27.79,34.72 27.15,34.09 27.15,32.72 25.17,30.73 v25.17,30.58 | v24,4.78 D2.3
  Bottom 0.152: JP21.5 57.05,41.1 58.14,40.01 58.67,40.01 58.78,39.9 58.78,39.29 57.94,38.46 50.85,38.46 50.57,38.18 v50.57,37.72 | v48.72,37.72 48.46,37.47 42.85,37.47 42.32,36.93 42.19,36.93 41.2,35.94 39.32,35.94 v38.91,35.53 | v25.17,30.58 25.17,28.65 23.82,27.3 23.82,4.95 v24,4.78
DI3  (via drill 0.25)
  Top 0.152: 59.49,41.1 61.32,42.93 63.14,42.93 64.8,44.58 64.8,45.37 U3.11 | 59.49,41.1 59.49,40.28 59.82,39.95 59.82,36.78 60.78,35.81 69.42,35.81 70.99,34.24 72.64,34.24 73.64,33.25 v73.64,32.87 | JP21.6 59.49,41.1 | v74.73,30.43 74.73,24.59 LED.3
  Bottom 0.152: v74.73,30.43 74.73,30.48 73.64,31.57 v73.64,32.87
DI4  (via drill 0.25)
  Top 0.152: JP21.7 62.08,41.1 | 62.08,41.1 65.3,44.32 65.3,46 U3.12 | 62.08,41.1 62.08,40.81 62.89,40.01 62.89,37.24 63.91,36.22 69.52,36.22 71.12,34.62 73.53,34.62 75.21,32.94 v75.21,32.87 | v76.22,30.4 76.22,20.95 75.11,19.84 D4.3
  Bottom 0.152: v75.21,32.87 75.21,31.42 v76.22,30.4
DO1  (via drill 0.25)
  Top 0.152: U3.14 65.58,47.73 66.12,47.19 66.12,44.4 63.68,41.96 JP21.8 | v53.37,36.88 v51.84,36.88 | v35.59,33.2 31.42,33.2 28.68,30.45 v28.68,29.01 | v36.93,35.1 37.11,34.92 39.47,34.92 39.6,35.05 v39.73,35.05
  Bottom 0.152: JP21.8 63.68,40.77 62.89,39.98 62.89,38.56 62.36,38.02 54.81,38.02 53.67,36.88 v53.37,36.88 | v51.84,36.88 51.84,36.7 51.71,36.58 42.98,36.58 42.67,36.27 42.11,36.27 41.38,35.53 40.08,35.53 39.73,35.18 v39.73,35.05 | v35.59,33.2 35.59,33.76 v36.93,35.1 | v28.68,29.01 28.68,27.3 26.16,24.79 26.16,22.75 D1.4
DO2  (via drill 0.25)
  Top 0.152: v56.39,36.42 v55.12,36.42 | v43.28,35.71 43.28,34.47 43.51,34.24 43.51,33.78 43.16,33.43 42.34,33.43 v42.01,33.76 | v39.47,33.12 37.72,33.12 36.6,32 31.95,32 30.38,30.43 30.38,24.71 28.8,23.14 28.8,19 30.5,17.3 30.5,9.5 27.36,6.35 D2.4 | JP21.9 66.22,43.87 66.7,44.35 66.7,47.99 U3.15
  Bottom 0.152: JP21.9 65.59,41.1 64.9,40.41 64.9,38.3 64.21,37.62 56.9,37.62 56.39,37.11 v56.39,36.42 | v55.12,36.42 55.12,36.3 54.74,35.92 43.48,35.92 v43.28,35.71 | v39.47,33.12 41.68,33.12 42.01,33.45 v42.01,33.76
DO3  (via drill 0.25)
  Top 0.152: 68.13,41.1 66.98,39.95 66.98,37.11 67.51,36.58 69.8,36.58 71.4,34.98 74.75,34.98 v76.83,32.89 | LED.4 77.64,29.99 v78.03,30.38 | v79.38,13.46 79.38,11.58 82.53,8.43 85.67,8.43 86.03,8.08 88.6,8.08 JP12.3 | 68.13,41.1 68.13,41.78 67.26,42.65 67.26,48.56 U3.16 | JP21.10 68.13,41.1
  Top 0.254: R13.2 100.18,9.02 99.21,9.98 91.45,9.98 JP12.3
  Bottom 0.152: v76.83,32.89 76.83,31.57 v78.03,30.38 | LED.4 77.99,22.95 79.38,21.57 v79.38,13.46
DO4  (via drill 0.25)
  Top 0.152: U3.17 66.7,51.05 v67.49,50.27 | v69.44,37.64 69.55,37.64 71.86,35.33 75.87,35.33 78.31,32.89 v79.53,32.89 | v79.93,30.4 79.93,23.9 v80.75,23.09
  Bottom 0.152: v69.44,37.64 68.4,37.64 66.98,39.06 66.98,39.95 67.46,40.44 67.46,41.78 67.84,42.16 | v79.53,32.89 79.53,30.81 v79.93,30.4 | v80.75,23.09 80.75,10.56 D4.4 | 67.84,42.16 67.92,42.24 70.16,42.24 JP21.11 | v67.49,50.27 67.49,42.52 67.84,42.16
DVCC
  Bottom 0.254: 63.98,23.95 65.08,22.86 65.08,7.04 67.6,4.51 S2.2
ECG_IN+
  Top 0.152: IC2.2 100.48,35.26 103.68,38.46 103.68,45.28 JP25.1
ECG_IN-
  Top 0.152: JP25.3 101.5,37.62 99.82,35.94 98.8,35.94 IC2.3
EDA_IN+
  Top 0.152: IC6.2 9.44,20.41 8.79,21.06 8.38,21.06 7.9,20.57 7.9,19.84 6.63,18.57 5.94,18.57 5.13,19.38 5.13,22.32 JP14.3
  Top 0.254: R23.1 10.31,16.5 | 10.31,16.5 8.89,16.5 R29.2 | IC6.2 9.44,17.97 10.29,17.12 10.29,16.52 10.31,16.5
EDA_IN-
  Top 0.152: R29.1 7.17,16.49 R24.2 4.27,17.75 3.48,18.55 JP14.1
  Top 0.254: IC6.1 8.79,19.28 7.16,17.65 7.16,16.5 R29.1
EMG_A1_OUT  (via drill 0.25)
  Top 0.152: C31.2 3.27,33.8 v4.32,34.85 5.75,33.41 R35.1 6.24,33.2 R37.2 | IC5.8 v5.87,41.68
  Bottom 0.152: v5.87,41.68 5.87,39.5 4.32,37.95 v4.32,34.85
EMG_BUFF_OUT  (via drill 0.25)
  Top 0.152: IC5.6 IC5.7 5.78,48.45 v5.71,48.39 | R33.2 3.21,40.37 v3.68,40.84
  Bottom 0.152: v5.71,48.39 5.71,42.88 v3.68,40.84
EMG_IN+  (via drill 0.25)
  Top 0.152: IC3.2 4.92,55.79 v4.14,55.02
  Bottom 0.152: v4.14,55.02 4.14,53.54 1.47,50.88 1.47,45.23 JP13.1
EMG_IN-  (via drill 0.25)
  Top 0.152: IC3.3 5.49,55.14 5.16,54.81 v5.16,53.14
  Bottom 0.152: v5.16,53.14 5.16,52.81 3.17,50.83 JP13.3
EMG_INA_OUT  (via drill 0.25)
  Top 0.152: IC3.6 9.6,55.14 v9.47,55.27 | R27.2 1.88,55.81 v1.83,55.85 | IC5.5 v8.18,49.83 v8.18,49.84
  Bottom 0.152: v1.83,55.85 8.89,55.85 v9.47,55.27 8.18,53.98 v8.18,49.84
GND  (via drill 0.25)  (1 unrouted)
  Top 0.152: U3.5 | U3.21 64.41,53.49 | C10.2 69.59,53.42 v69.29,53.72 | R44.1 71.23,49.42 R8.1 v69.37,48.56 | v71.48,46.51 71.48,45.66 C4.2
  Top 0.254: C17.2 v98.8,38.41 v98.81,38.41 | IC4.11 v95.81,47.47 | IC5.11 v8.83,43.98 v8.84,43.99 | C27.2 v12.55,43.72 v12.55,43.71 | IC3.4 7.46,54.49 v7.47,54.48 | IC2.4 v97.62,36.55 v97.61,36.55 | IC6.4 v10.74,20.95 | C24.2 v12.68,20.15 v12.68,20.14 | U4.3 v102.76,22.16 v102.77,22.17 | U4.7 U4.6 | U4.6 U4.5 | U4.6 v100,24.89 | C15.2 v97.15,25.63 v97.16,25.63 | C16.2 v102.41,26.82 | C13.2 v102.21,17.47 v102.21,17.48 | C14.1 v97.09,16.32 v97.08,16.31 | R12.1 15.27,7.05 JP26.2 | U3.5 v59.97,47.88 | v58.98,48.82 58.64,48.82 U3.3 | 64.41,53.49 v63.52,52.6 | C11.2 v50.47,55.07 | C12.2 v46.51,45.52 | JP12.2 90.85,5.6 93.45,8.2 LED4.C | v13.21,52.93 C29.2 | C19.2 98.67,41.36 v98.68,41.38 | R10.1 52.44,51.09 v52.43,51.08 | C3.2 v52.7,46.91 | v52.7,46.91 | R9.1 52.57,53.99 v52.55,53.98 | R42.1 42.78,55.64 v42.75,55.6 | R7.1 41.83,53.83 v41.73,53.82 | R6.1 v41.83,47.22 | C25.2 v6.81,19.97 v6.81,19.96 | R26.2 v13.87,29.06
  Bottom 0.254: 50.98,42.16 JP21.3 50.98,41.07 | 50.98,42.16 | 50.98,41.07 49.94,41.07 | 50.98,41.07 52.15,41.07 | 61.01,31.73 61.01,28.37 61.85,27.53 62.43,27.53 v62.59,27.38 | 85.98,45.01 87,45.01 87.5,44.5 JP9.2 | 85.7,21.41 88.59,21.41 JP10.2 | 85.78,5.61 89.08,5.61 JP12.2 | JP26.2 17.14,7.59 17.53,7.21 19.1,7.21 | 17.86,22.3 19.13,22.3 | 17.55,46.51 19.23,46.51 | 44.96,40.06 44.96,38.05 45.16,37.85 46.97,37.85 47.52,38.41 48.95,38.41 49.05,38.3 49.58,38.3 49.58,37.11 49.68,37.01 51.1,37.01 51.18,37.08 51.18,37.64 51.21,37.67 52.53,37.67 52.58,37.62 52.58,36.4 52.7,36.27 53.87,36.27 54.53,36.93 54.53,37.06 54.74,37.26 55.75,37.26 55.75,36.09 55.7,36.04 55.7,35.61 56.26,35.05 57.45,35.05 57.53,35.13 57.53,36.5 57.66,36.63 59.44,36.63 60.55,35.51 63.2,35.51 63.25,35.56 67.26,35.56 68.43,34.39 68.43,33.3 69.52,32.21 72.42,32.21 72.8,32.59 72.8,33.02 74.04,34.27 74.04,34.49 75.21,35.66 75.72,35.66 76.66,36.6 76.66,37.34 75.77,38.23 75.77,38.28 77.09,39.6 77.09,40.89 76.5,41.48 76.5,41.55 76.3,41.76 76.3,46.63 76.45,46.48 78.84,46.48 79.93,47.57 79.93,49.48 79.7,49.71 77.32,49.71 75.1,51.92 ECG.2 76.29,52.67 76.38,52.76 | 50.98,42.16 50.98,42.42 | U$2.2 64.44,25.76 v64.67,25.98
  pour Bottom: 19,60 19,0 31,0 31,30 32,31 73,31 74,30 74,0 86,0 86,60 74,60 74,41 72,39 33,39 31,41 31,60
  pour Bottom: 32,60 32,40 73,40 73,60
  pour Bottom: 0,60 0,31.5 18,31.5 18,60
  pour Bottom: 0,30.5 0,14 18,14 18,30.5
  pour Bottom: 87,60 87,31.5 105,31.5 105,60
  pour Bottom: 87,30.5 87,14 105,14 105,30.5
  pour Top: 52.83,30.48 52.83,0 73.66,0 73.66,30.48
INA_ECG_OUT  (via drill 0.25)
  Top 0.152: IC2.6 93.33,35.91 93.24,35.81 93.24,34.62 v92.73,34.11 91.95,33.33 R14.2 | IC4.5 96.46,44.28 v96.44,44.3
  Bottom 0.152: v96.44,44.3 96.44,37.82 v92.73,34.11
INA_ECG_VREF  (via drill 0.25)
  Top 0.152: IC2.5 94.24,37.21 v93.98,37.47 | C18.2 v90.16,37.92 v90.17,37.92 | IC4.1 v93.19,43.03
  Bottom 0.152: v90.17,37.92 92.33,37.92 | 92.33,37.92 93.52,37.92 v93.98,37.47 | v93.19,43.03 93.19,40.11 92.28,39.19 92.28,37.97 92.33,37.92
INA_EMG_VREF
  Top 0.152: IC3.5 9.55,54.48 9.45,54.39 C26.2 9.47,52.45 9.47,50.57 10.78,49.26 IC5.1
N$1  (via drill 0.25)
  Top 0.254: R2.1 56.34,8.84 v56.34,7.98 56.34,6.75 PTC.2 | C6.1 63.95,12.59 63.14,11.79 63.14,9.63 63.35,9.42 64.47,9.42 U1.4 64.52,9.44 64.52,8.84 61.92,6.25 v60.96,6.25
  Bottom 0.254: v56.34,7.98 57.35,6.96 60.25,6.96 v60.96,6.25
N$2
  Top 0.254: U1.5 64.5,11.01 65.73,9.78 65.73,8.38 65.61,8.26 64.54,8.26 63.07,6.78 63.07,6.45 61.92,5.31 59.32,5.31 R1.2
N$3
  Top 0.254: R2.2 57.84,10.74 LED1.A
N$4  (via drill 0.25)
  Top 0.254: LED1.C v57.91,8.31 | U1.1 61.56,11.33 v60.71,12.19
  Bottom 0.254: v57.91,8.31 57.91,8.64 60.68,11.4 60.68,12.17 v60.71,12.19
N$5
  Top 0.254: U2.5 66.08,19.15 L10.1
N$6
  Top 0.254: IC1.3 54.45,12.39 R3.1 | R3.1 | R3.1 54.03,15.87 C39.1 54.06,16.01 R4.2
N$7
  Top 0.254: U5.4 69.95,15.49 69.95,15.72 70.43,15.72 70.97,16.26 71.83,16.26 C38.1 71.69,16.26
N$8
  Top 0.152: U3.20 65.62,53.54 65.63,53.54 65.99,53.9 68.19,53.9 C10.1
N$9
  cutout Bottom: 35.05,59.18 35.05,56.03 38.86,56.03 38.86,57.4 43.69,57.4 43.69,59.18
N$10  (via drill 0.25)
  Top 0.152: C12.1 49.37,47.68 Q1.1 49.79,48.03 v55.07,48.03 | U3.7 60.02,45.72 59.51,45.21 57.86,45.21 v57.3,45.77
  Bottom 0.152: v55.07,48.03 55.07,48.01 v57.3,45.77
N$11  (via drill 0.25)
  Top 0.152: C11.1 47.73,52.84 Q1.3 47.36,50.48 48.56,49.28 48.56,44.58 49.33,43.81 v49.35,43.81 | U3.8 60.55,45.16 60.02,44.63 55.78,44.63 v55.75,44.65
  Bottom 0.152: v49.35,43.81 54.91,43.81 v55.75,44.65
N$12
  Top 0.152: R6.2 38.88,49.02 LED2.C
N$13  (via drill 0.25)
  Top 0.152: U$1.P$1 v46.16,7.11 v46.15,7.11
  Bottom 0.152: JP23.2 46.14,7.13 v46.15,7.11
N$14  (via drill 0.25)
  Top 0.152: U$1.P$2 v47.76,8.61 v47.75,8.61
  Bottom 0.152: JP24.2 47.74,8.62 v47.75,8.61
N$15
  Top 0.152: LED3.C R7.2
N$16
  Top 0.152: 66.22,51.8 66.22,51.82 66.9,52.5 66.98,52.5 68.17,51.31 68.17,46.56 C4.1
  Top 0.254: 66.2,51.8 U3.18 66.22,51.8 | L9.2 69.42,45.3 C4.1
N$17
  Top 0.254: C5.1 63.84,16.47 U2.4
N$19
  Top 0.152: R28.1 7.7,56.95 7.19,56.44 IC3.1
N$20
  Top 0.152: R28.2 9.4,56.69 9.65,56.44 IC3.8
N$22
  Bottom 0.254: JP16.3 35.82,51.42 | 35.82,51.42 36.68,52.27 JP4.1 | 35.82,51.42 36.95,50.29 39.24,50.29 40.8,51.85 JP3.1
N$23
  Top 0.254: IC3.7 10.77,55.8 C29.1 L14.2
N$24
  Top 0.254: C17.1 95.54,35.57 95.22,35.26 IC2.7 | C17.1 | C17.1 95.06,38.89 93.27,38.89 L11.1
N$25
  Top 0.254: C27.1 9.18,46.45 8.84,46.79 IC5.4 | C27.1 12.55,47.93 11.72,48.75 11.73,48.76 L15.2 | C27.1
N$26
  Top 0.254: JP2.1 56.42,5.28 56.19,5.51 54.76,5.51 54.52,5.75 PTC.1 54.53,6.87
N$27
  Top 0.254: LED4.A 99.51,5.2 R13.1
N$28
  Top 0.152: IC2.1 98.13,34.6 97.48,33.96 RG.2
N$29
  Top 0.152: RG.1 95.79,33.95 95.15,34.59 94.25,34.59 IC2.8
N$30  (via drill 0.25)
  Top 0.152: C18.1 88.88,34.82 | 88.88,34.82 88.88,33.71 R14.1 | IC4.2 94.51,43.82 94.08,44.25 92.35,44.25 v91.67,43.56 | v88.88,34.85 88.88,34.83 88.88,34.82
  Bottom 0.152: v91.67,43.56 91.67,42.42 88.9,39.65 88.9,34.87 v88.88,34.85
N$31
  Top 0.152: IC4.10 96.46,55.42 C21.2 96.42,57.89 R16.1
N$32
  Top 0.152: R16.2 98.43,55.99 C20.1 98.95,56.02 R15.1
N$34
  Top 0.152: R17.2 99.33,51.07 R18.1 97.96,49.78 97.59,49.78 97.11,49.3 IC4.9
N$35  (via drill 0.25)
  Top 0.254: C37.2 68.67,7.81 v70.21,9.35 70.21,9.89 R43.1 | R47.2 68.24,19.71 68.73,19.71 69.11,19.33 69.11,17.14 v69.6,16.66 68.96,16.03 U5.5
  Bottom 0.254: v70.21,9.35 70.21,16.05 v69.6,16.66
N$36
  Top 0.254: IC4.4 95.81,41.38 C19.1 | 95.81,41.38 C19.1 | L12.1 C19.1
N$37
  Top 0.152: R24.1 2.56,17.73 1.6,18.69 1.6,25.35 2.34,26.09 | 2.34,26.09 2.34,27.27 C28.1 | 2.34,26.09 2.64,26.39 R32.2
N$38  (via drill 0.25)
  Top 0.152: IC4.12 C22.2 | C22.2 | C22.2 95.16,53 v94.92,53.24 | R20.1 92.22,53.65 v92.41,53.47
  Bottom 0.152: v94.92,53.24 92.63,53.24 v92.41,53.47
N$39
  Top 0.152: C23.1 92.28,58.15 | 92.28,58.15 R19.1 | R20.2 92.22,58.09 92.28,58.15
N$40  (via drill 0.25)
  Top 0.152: C25.1 6.81,24.39 v7.75,25.32 7.96,25.54 R32.1 7.98,26.38 | IC6.5 10.74,25.45 v10.77,25.48
  Bottom 0.152: v10.77,25.48 7.9,25.48 v7.75,25.32
N$41  (via drill 0.25)
  Top 0.152: IC4.13 94.51,49.89 v94.49,49.91 | v89.36,51.66 89.27,51.75 R22.1 88.53,53.52 R21.2
  Bottom 0.152: v94.49,49.91 91.97,49.91 91.26,49.2 90.32,49.2 89.38,50.14 89.38,51.64 v89.36,51.66
N$42
  Top 0.152: R25.2 10.06,29.06 | 10.06,29.06 R26.1 | IC6.6 10.09,29.02 10.06,29.06
N$43
  Top 0.254: JP25.2 101.22,45.47 100.15,46.53 99.38,46.53 R30.2
N$44
  Top 0.254: C2.1 59.33,15.27 IC1.5 | 58.24,14.4 IC1.5 | L1.2 58.25,14.4 IC1.5
N$45
  Top 0.254: R31.2 4.65,47 JP13.2
N$46
  Top 0.254: IC6.8 8.79,23.49 9.27,23.01 12.17,23.01 | 12.17,23.01 C24.1 | L13.1 12.22,23.07 12.17,23.01
N$50
  Top 0.254: U$1.P$12 L6.2 C42.1
N$51
  Top 0.254: 58.02,12.39 IC1.4 57.43,13.31 57.43,13.95 57.07,14.3 | 57.07,14.3 IC1.1 | R46.2 56.31,17.37 57.1,16.59 57.1,14.33 57.07,14.3
N$55
  Top 0.152: R27.1 2.92,53.09 3.53,52.47 C26.1 7.75,51.46 10.13,49.08 IC5.2
N$57
  Top 0.152: R34.1 3.24,36.66 C33.2 6.69,40.19 8.18,41.68 IC5.10
N$59
  Top 0.152: R33.1 1.51,36.44 R34.2 1.54,33.17 C31.1
N$65  (via drill 0.25)
  Top 0.152: IC5.9 7.53,44.03 v7.52,44.04 | v6.71,38.33 6.67,38.3 R36.1 6.03,36.54 R35.2
  Bottom 0.152: v6.71,38.33 6.71,40.92 7.52,41.73 v7.52,44.04
N$66  (via drill 0.25)
  Top 0.152: IC5.12 9.48,41.92 v9.12,41.55 | C34.2 12.91,36.31 v13.16,36.07 13.44,35.79 R38.1
  Bottom 0.152: v13.16,36.07 13.16,37.52 v9.12,41.55
N$67
  Top 0.152: C32.1 R38.2 13.42,33.2 R37.1
N$70  (via drill 0.25)
  Top 0.152: R39.2 14.95,39.33 v14.22,40.06 14.2,40.08 R40.1 | IC5.13 v10.13,44.07
  Bottom 0.152: v10.13,44.07 10.13,42.85 12.22,40.77 13.51,40.77 v14.22,40.06
RESET  (via drill 0.25)
  Top 0.152: v48.28,50.85 v51.08,50.85 | v54.79,52.53 54.94,52.53 56.54,54.13 57.17,54.13 U3.29 | v41.78,45.34 43.8,45.34 R5.1 43.91,45.34 45.11,45.34 45.34,45.57 v45.34,49.84
  Bottom 0.152: v45.34,49.84 47.27,49.84 v48.28,50.85 | v51.08,50.85 51.18,50.85 52.86,52.53 v54.79,52.53 | 41.73,45.34 v41.78,45.34 41.12,45.34 39.58,43.8 JP16.6
RXI  (via drill 0.25)
  Top 0.152: U3.30 57.8,52.36 v57,53.16 | v38.84,41.22 35.1,44.96 v35.1,45.14 | JP16.4 34.18,48.88 v35.27,47.79 | v42.93,34.01 42.93,34.21 v39.32,37.82 | v44.2,21.49 44.2,24.77 v44.15,24.82
  Bottom 0.152: v57,53.16 51.64,53.16 47.36,48.88 36.36,48.88 v35.27,47.79 35.28,47.78 35.28,46.33 35.1,46.15 v35.1,45.14 | v42.93,34.01 42.93,30.53 43.42,30.04 JP18.4 43.41,28.99 43.41,25.55 v44.15,24.82 | v39.32,37.82 38.84,38.3 v38.84,41.22 | v44.2,21.49 44.2,8.06 JP23.1
SCL  (via drill 0.25)
  Top 0.152: U3.28 58.94,53.61 56.74,55.8 v56.74,56.87 | JP20.3 66.22,58.77 67.87,57.12 67.87,56.55 R48.1
  Bottom 0.152: JP20.3 64.62,57.3 57.1,57.3 56.74,56.95 v56.74,56.87
SDA  (via drill 0.25)
  Top 0.152: 59.61,54.06 U3.27 59.5,54.29 v58.6,55.19 | R45.1 69.58,58.08 JP20.2
  Bottom 0.152: JP20.2 66.25,56.39 58.93,56.39 58.6,56.06 v58.6,55.19
ST  (via drill 0.25)
  Top 0.152: U4.2 102.39,21.52 v102.74,21.16
  Bottom 0.152: JP10.3 89.75,23 90.7,22.05 90.7,17.6 92.02,16.28 95.28,16.28 97.56,18.57 101.52,18.57 102.74,19.79 v102.74,21.16
STATUS_BT  (via drill 0.25)
  Top 0.152: U3.13 64.95,47.42 v64.14,48.23 | v41.78,54.76 38.12,54.76 37.36,54 33.5,54 JP16.2 | v29.69,44.07 29.69,41.02 32.79,37.92 32.79,35.71 v32.92,35.59 | U$1.P$24 37.62,22.11 v37.64,22.12
  Bottom 0.152: JP18.2 | v64.14,48.23 56.52,55.85 49.91,55.85 49,54.94 41.96,54.94 v41.78,54.76 | v29.69,44.07 29.69,45.16 29.31,45.54 29.31,49.2 30.91,50.8 30.91,51.36 31.34,51.79 32,51.79 33.5,53.29 JP16.2 | JP18.2 37.8,29.55 37.8,31.09 36.68,32.21 34.9,32.21 32.79,34.31 32.79,35.46 v32.92,35.59 | JP18.2 38.34,22.82 v37.64,22.12
TXO  (via drill 0.25)
  Top 0.152: U3.31 57.3,51.8 v58.12,50.98 | v36.25,45.74 36.27,45.74 | v36.25,45.74 36.25,45.77 35.69,46.33 JP16.5 | v40.23,41.22 36.32,45.14 36.32,45.67 v36.25,45.74 | v42.32,37.82 42.32,37.64 v45.95,34.01 | v45.97,24.79 45.97,21.51 v45.95,21.49
  Bottom 0.152: v58.12,50.98 57.99,51.1 54.59,51.1 51.44,47.95 38.81,47.95 36.6,45.74 v36.25,45.74 | v42.32,37.82 40.89,39.24 40.89,40.56 v40.23,41.22 | v45.95,34.01 v45.96,34 JP18.5 45.96,24.8 v45.97,24.79 | v45.95,21.49 45.95,9.7 JP24.1
VBAT  (via drill 0.25)
  Top 0.254: C7.1 59.91,9.45 U1.3 61.92,9.29 v61.92,8.05 | S2.3 70.23,4.11 v69.04,2.92
  Bottom 0.254: v61.92,8.05 61.92,2.52 62.33,2.11 63.52,2.11 64.34,2.92 v69.04,2.92
VCC  (via drill 0.25)  (1 unrouted)
  Top 0.254: JP9.1 90.55,42.5 91.67,41.38 92.64,41.38 L12.2 | JP6.1 15.71,48.5 13.43,50.78 L15.1 | JP6.1 15.93,48.57 15.93,49.86 15,50.79 L14.1 | JP8.1 15.98,25 14.15,23.16 14.15,17.28 R23.2 | 99.35,17.98 99.35,18.49 90.25,18.49 89.74,19 JP10.1 88.42,19 87.25,20.17 85.88,20.17 85.85,20.19 | 99.35,17.98 C13.1 | U$10.COLLECTOR 14.48,8.26 JP26.1 15.95,9.6 17.4,8.15 19.05,8.15 | 99.36,19.97 U4.14 | 99.36,19.97 99.98,19.97 U4.15 | 99.36,19.97 99.36,18 99.35,17.98 | JP8.1 14.8,26.2 L13.2 | C9.1 64.77,20.43 L10.2 66.19,20.43 66.19,21.26 | R3.2 54.69,11.11 v55.09,11.51 | JP19.3 JP22.3 56.82,28.4 58.85,30.43 58.85,31.29 58.88,31.32 58.88,31.88 66.98,31.88 68.3,33.2 68.3,33.55 72.54,33.55 72.77,33.33 72.77,32.44 73.41,31.8 78.84,31.8 78.89,31.75 78.89,29.26 79.5,28.65 79.5,20.45 79.45,20.4 LED.1 | 66.19,21.26 65.43,22.02 65.43,24.08 64.34,25.17 61.87,25.17 60.38,26.67 v60.38,27.08 | JP9.1 88.59,42.5 87,44.09 85.98,44.09 85.95,44.12 | JP9.1 89,41.29 91.32,38.97 L11.2 | JP12.1 88.55,3.6 87.38,4.78 85.93,4.78 | 15.98,25.02 16.36,25.02 17.53,23.85 19.1,23.85 | 15.95,25.02 15.98,25.02 | 15.98,25.02 JP8.1 | 15.99,48.51 16.51,48.51 17.68,47.35 19.23,47.35 | 44.96,38.91 44.96,40.08 | 45.9,41.07 45.9,42.37 | 45.9,41.07 46.97,41.07 | 45.9,41.07 44.81,41.07 | 15.9,48.51 15.99,48.51 | 15.99,48.51 JP6.1 | L1.1 v58.25,19.96 v58.24,19.96 | 45.9,41.07 JP21.1 | 45.9,41.07 | 66.19,21.26 66.19,21.38 C41.1
  Bottom 0.254: v55.09,11.51 55.09,16.82 v58.24,19.96 58.24,25.65 JP22.3 v60.38,27.08 | JP3.2 v42.6,52.27
  pour Top: 19,60 19,0 31,0 31,30 32,31 73,31 74,30 74,0 86,0 86,60 74,60 74,41 72,39 33,39 31,41 31,60
  pour Top: 32,60 32,40 73,40 73,60
VDD  (via drill 0.25)  (1 unrouted)
  Top 0.152: JP20.11
  Top 0.254: C37.1 66.83,9.68 65.94,10.57 65.94,13.5 C35.1 66.72,13.53 67.67,14.48 68.02,14.48 | 68.02,14.48 70.52,14.48 R43.2 | 68.02,14.48 U5.6 v68.02,16.69 | v40.11,56.49 40.11,57.15 41.86,58.9 JP20.11 | v42.98,41.15 37.41,46.71 37.41,50.32 v38.12,51.03 | v50.11,32.13 41.2,32.13 40.89,31.83 40.89,29.01 JP18.3 | v67.08,33.02 67.08,33.43 66.55,33.96 v47.65,33.96 47.65,34.72 v44.09,38.28 | C40.1 50.8,20.75 v50.77,20.78 L6.1
  Bottom 0.254: v50.77,20.78 47.98,23.57 41.76,23.57 40.88,24.45 JP18.3 | 40.12,56.67 v40.11,56.49 39.03,55.42 JP4.2 | JP17.3 69.28,27.08 70.59,25.77 70.59,19.25 v68.02,16.69 | v67.08,33.02 67.08,30.48 69.24,28.32 JP17.3 | v42.98,41.15 42.98,39.17 43.87,38.28 v44.09,38.28 | v50.11,32.13 49.48,32.13 v47.65,33.96 | 39.03,51.33 38.73,51.03 v38.12,51.03 | JP7.3 JP17.3
VREF  (via drill 0.25)
  Top 0.254: JP9.3 96.78,46.5 98.42,44.86 99.35,44.86 R30.1 | IC4.3 95.16,44.52 94.72,44.96 90.54,44.96 JP9.3 | JP9.3 89.05,46.5 91.21,48.67 91.21,49.86 | 91.21,49.86 v91.21,50.39 | v91.21,50.39 91.21,52.53 R22.2 | C22.1 92.45,51.1 91.21,49.86 | C21.1 94.72,54.26 91.75,51.28 91.75,50.93 v91.21,50.39 | R18.2 v97.59,52.15 | R31.1 6.92,45.3 v6.93,45.29 | IC5.3 9.48,47.17 v9.47,47.17 | R36.2 8.38,40.09 C33.1 9.83,40.11 | C34.1 11.21,40.05 R40.2 11.16,40.11 9.83,40.11 | 9.83,40.11 9.8,40.13 9.8,41.05 10.29,41.53 12.34,41.53 15.31,44.5 JP6.3 16.68,43.81 21.72,43.81 | IC6.3 10.09,20.47 9.7,20.85 9.7,21.29 v9.6,21.39 | R46.1 56.31,19.76 55.42,20.65 55.42,24.49 | JP19.2 55.37,24.54 55.42,24.49 | 55.42,24.49 55.47,24.54 JP22.2 57.24,24.12 C30.1 | v69.11,35.18 v58.85,35.18 58.7,35.03 v49.05,35.03 49.05,35.66 v46.48,38.46 | v72.34,37.69 72.57,37.69 73.33,38.46 ACC.4 | JP9.3 88.94,46.56 81.66,46.56 v79.68,44.58 79.68,44.53 v77.62,42.47 | 21.72,43.81 23.14,42.39 23.14,40.59 25.07,38.66 v25.09,38.66 | 21.72,43.81 21.74,43.81 v23.93,46 | v21.44,20.7 22.68,20.7 23.85,21.87 23.85,30.99 26.01,33.15 v26.01,33.43 | 28.32,33.71 v28.37,33.76 28.93,34.31 40.77,34.31 v40.92,34.47
  Bottom 0.254: v97.59,52.15 92.96,52.15 v91.21,50.39 | v6.93,45.29 13.56,45.29 | 13.56,45.29 14.35,44.5 JP6.3 | v9.47,47.17 11.68,47.17 13.56,45.29 | v9.6,21.39 10.08,21.87 11.15,21.87 11.61,21.41 13.49,21.41 13.9,21 JP8.3 17.35,21 17.65,20.7 v21.44,20.7 | JP19.2 55.15,24.54 55.47,24.87 55.47,28.17 56.87,29.57 57.99,29.57 58.85,30.43 v58.85,35.18 | v69.11,35.18 69.83,35.18 v72.34,37.69 | ECG.4 81.03,50.56 81.03,45.92 v79.68,44.58 | ACC.4 77.64,42.45 v77.62,42.47 | v49.05,35.03 41.12,35.03 40.92,34.82 v40.92,34.47 | 27.36,35.13 EDA.4 26.7,37.05 v25.09,38.66 | v23.93,46 23.93,49.12 EMG.4 | v26.01,33.43 26.01,33.78 27.36,35.13 | JP21.2 48.23,40.89 47.55,40.89 46.48,39.83 v46.48,38.46 | v28.37,33.76 28.37,34.11 27.36,35.13
X_OUT  (via drill 0.25)
  Top 0.152: U4.12 96.48,20.86 v96.47,20.85 | C14.2 v94.31,17.45
  Bottom 0.152: v96.47,20.85 96.47,19.61 v94.31,17.45 92.5,19.26 JP5.1
Y_OUT  (via drill 0.25)
  Top 0.152: U4.10 v96.48,22.16 v96.47,22.17 96.3,22 JP5.2 | C15.1 v95.45,25.68
  Bottom 0.152: v96.47,22.17 96.44,22.17 95.43,23.19 95.43,25.65 v95.45,25.68

## Text on the board
Bottom: BITalino | V3.1
_tsilk: EMG | MCU | ECG | EDA | BT | PWR | ACC | - | + | LUX | LED | ON | OFF
_bsilk: DVCC | A6 | DGND | A1 | A2 | A3 | A4 | A5 | SCL | SDA | GP | AVCC | DGND | A4 | AGND | VSS | AGND | VSS | STAT | A1 | AVCC | DVCC | AVCC | A4 | RX | IN- | VSS | IN+ | AGND | TX | REF | VSS | REF | AGND | IN+ | A1 | RST | AVCC | IN- | AVCC | VSS | AGND | I1 | I2 | I3 | I4 | O1 | O2 | O3 | O4 | AVCC | A5 | AGND | VSS | VSS | AGND | A2 | AVCC | 2013.05.07 | 2013.05.07 | DGND | STAT | DVCC | TX | RX | NC | AVCC | AVCC | DVCC | AVCC | I3 | A5 | IN- | AGND | O3 | Z | AGND | VSS | ABAT | AGND | ST | NC | O1 | Y | VSS | I1 | AVCC | AGND | IN+ | AGND | DGND | X | A2 | AVCC | 2013.05.07 | 2013.05.07 | AVCC | I4 | AVCC | NC | AGND | O4 | AGND | O2 | AGND | O3 | I2 | ON | OFF | AVCC | NC | AGND | A3 | AVCC | 2013.05.07 | 2013.05.07